# Altium schematic sheet Sheet1.SchDoc
size A4
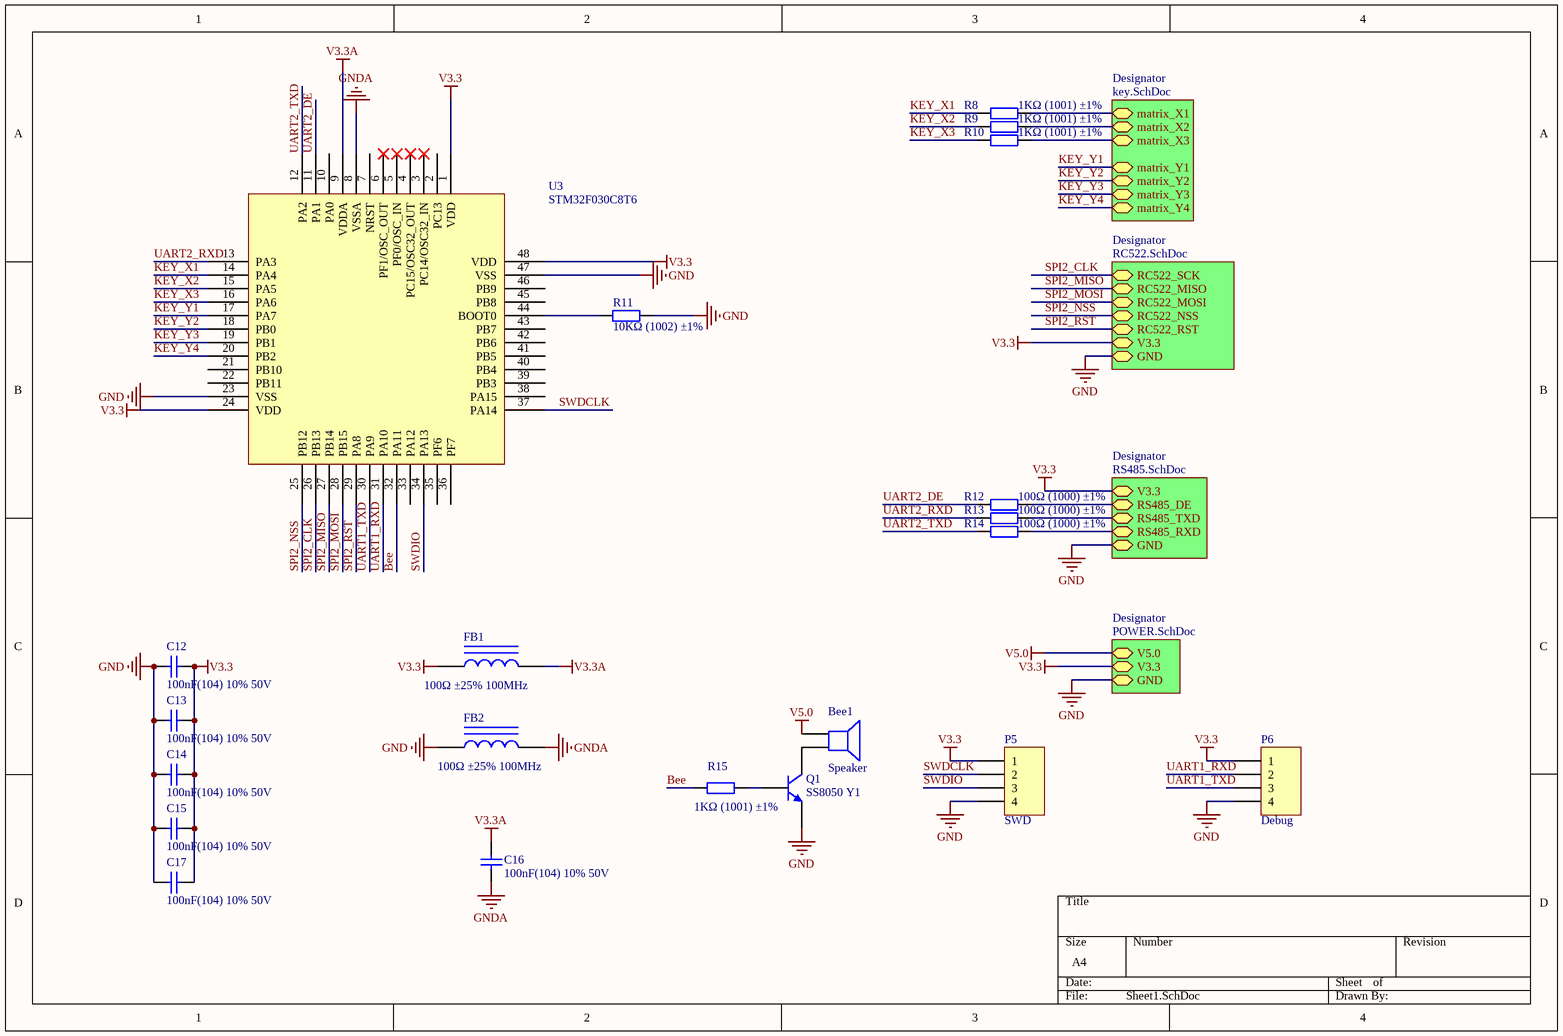
[diagram p0: Sheet1.SchDoc]

## Parts
Bee1  Speaker  [Bee]
C12  100nF(104) 10% 50V  [0805_C]
C13  100nF(104) 10% 50V  [0805_C]
C14  100nF(104) 10% 50V  [0805_C]
C15  100nF(104) 10% 50V  [0805_C]
C16  100nF(104) 10% 50V  [0805_C]
C17  100nF(104) 10% 50V  [0805_C]
FB1  100Ω ±25% 100MHz  [0805_L]
FB2  100Ω ±25% 100MHz  [0805_L]
P5  SWD  [HDR1X4]
P6  Debug  [HDR1X4]
Q1  SS8050 Y1  [SOT-23(SOT-23-3)]
R8  1KΩ (1001) ±1%  [0805_R]
R9  1KΩ (1001) ±1%  [0805_R]
R10  1KΩ (1001) ±1%  [0805_R]
R11  10KΩ (1002) ±1%  [0805_R]
R12  100Ω (1000) ±1%  [0805_R]
R13  100Ω (1000) ±1%  [0805_R]
R14  100Ω (1000) ±1%  [0805_R]
R15  1KΩ (1001) ±1%  [0805_R]
U3  STM32F030C8T6  [LQFP-48_7x7x05P]

## Sub-sheets
Designator = key.SchDoc: matrix_Y2, matrix_Y4, matrix_X1, matrix_Y1, matrix_X3, matrix_Y3, matrix_X2
Designator = RC522.SchDoc: RC522_SCK, RC522_MISO, RC522_MOSI, RC522_NSS, V3.3, RC522_RST, GND
Designator = RS485.SchDoc: V3.3, RS485_RXD, RS485_TXD, RS485_DE, GND
Designator = POWER.SchDoc: V5.0, V3.3, GND

## Nets
GND: C12.1 C13.1 C14.1 C15.1 C17.1 FB2.1 P5.4 P6.4 Q1.2(E) R11.2 U3.23(VSS) U3.47(VSS) ; sheet Designator/GND, sheet Designator/GND, sheet Designator/GND
GNDA: C16.1 FB2.2 U3.8(VSSA)
V3.3: C12.2 C13.2 C14.2 C15.2 C17.2 FB1.1 P5.1 P6.1 U3.1(VDD) U3.24(VDD) U3.48(VDD) ; sheet Designator/V3.3, sheet Designator/V3.3, sheet Designator/V3.3
V3.3A: C16.2 FB1.2 U3.9(VDDA)
V5.0: Bee1.1 ; sheet Designator/V5.0
Bee: R15.1 U3.32(PA11)
KEY_X1: R8.1 U3.14(PA4)
KEY_X2: R9.1 U3.15(PA5)
KEY_X3: R10.1 U3.16(PA6)
KEY_Y1: U3.17(PA7) ; sheet Designator/matrix_Y1
KEY_Y2: U3.18(PB0) ; sheet Designator/matrix_Y2
KEY_Y3: U3.19(PB1) ; sheet Designator/matrix_Y3
KEY_Y4: U3.20(PB2) ; sheet Designator/matrix_Y4
SPI2_CLK: U3.26(PB13) ; sheet Designator/RC522_SCK
SPI2_MISO: U3.27(PB14) ; sheet Designator/RC522_MISO
SPI2_MOSI: U3.28(PB15) ; sheet Designator/RC522_MOSI
SPI2_NSS: U3.25(PB12) ; sheet Designator/RC522_NSS
SPI2_RST: U3.29(PA8) ; sheet Designator/RC522_RST
SWDCLK: P5.2 U3.37(PA14)
SWDIO: P5.3 U3.34(PA13)
UART1_RXD: P6.2 U3.31(PA10)
UART1_TXD: P6.3 U3.30(PA9)
UART2_DE: R12.1 U3.11(PA1)
UART2_RXD: R13.1 U3.13(PA3)
UART2_TXD: R14.1 U3.12(PA2)
NetBee1_2: Bee1.2 Q1.3(C)
NetQ1_1: Q1.1(B) R15.2
NetR8_2: R8.2 ; sheet Designator/matrix_X1
NetR9_2: R9.2 ; sheet Designator/matrix_X2
NetR10_2: R10.2 ; sheet Designator/matrix_X3
NetR11_1: R11.1 U3.44(BOOT0)
NetR12_2: R12.2 ; sheet Designator/RS485_DE
NetR13_2: R13.2 ; sheet Designator/RS485_TXD
NetR14_2: R14.2 ; sheet Designator/RS485_RXD

Not connected (* = marked no-connect by the designer): U3 2(PC13) 3(PC14/OSC32_IN)* 4(PC15/OSC32_OUT)* 5(PF0/OSC_IN)* 6(PF1/OSC_OUT)* 7(NRST) 10(PA0) 21(PB10) 22(PB11) 33(PA12) 35(PF6) 36(PF7) 38(PA15) 39(PB3) 40(PB4) 41(PB5) 42(PB6) 43(PB7) 45(PB8) 46(PB9)

## Library data of the parts
Bee1 = Speaker: Loudspeaker; Published: 24-Mar-1999; LatestRevisionDate: 17-Jul-2002; LatestRevisionNote: Re-released for DXP Platform.; PackageReference: PIN2; Publisher: Altium Limited
C12-C17 = 0805 100nF(104) 10% 50V: 贴片电容; ComponentLink1Description: 供应商链接; ComponentLink1URL: http://www.szlcsc.com/product/details_50686.html; Package: 0805; Supplier: LC; SuppliersPartNumber: C49678
FB1 FB2 = 0805 100Ω 25% 100MHz: 贴片磁珠; ComponentLink1Description: 供应商链接; ComponentLink1URL: http://www.szlcsc.com/product/details_1367.html; Package: 0805; Supplier: LC; SuppliersPartNumber: C1015
P5 P6 = Header 4: Header, 4-Pin; LatestRevisionDate: 17-Jul-2002; LatestRevisionNote: Re-released for DXP Platform.; Publisher: Altium Limited
Q1 = SOT-23 SS8050 Y1: 三极管; ComponentLink1Description: 供应商链接; ComponentLink1URL: http://www.szlcsc.com/product/details_2507.html; Package: SOT-23; Supplier: LC; SuppliersPartNumber: C2150
R8-R10 R15 = 0805 1KΩ (1001) 1%: 贴片电阻; ComponentLink1Description: 供应商链接; ComponentLink1URL: http://www.szlcsc.com/product/details_18201.html; Package: 0805; Supplier: LC; SuppliersPartNumber: C17513
R11 = 0805 10KΩ (1002) 1%: 贴片电阻; ComponentLink1Description: 供应商链接; ComponentLink1URL: http://www.szlcsc.com/product/details_18102.html; Package: 0805; Supplier: LC; SuppliersPartNumber: C17414
R12-R14 = 0805 100Ω (1000) 1%: 贴片电阻; ComponentLink1Description: 供应商链接; ComponentLink1URL: http://www.szlcsc.com/product/details_18096.html; Package: 0805; Supplier: LC; SuppliersPartNumber: C17408
U3 = STM32F030C8T6: ARM; ComponentLink1Description: 供应商链接; ComponentLink1URL: http://www.szlcsc.com/product/details_24662.html; Package: LQFP-48_7x7x05P; Supplier: LC; SuppliersPartNumber: C23922